# Altium schematic sheet E_ink_stuff.SchDoc
size 558 x 431 mm; SheetNumber: 3; SheetTotal: 8
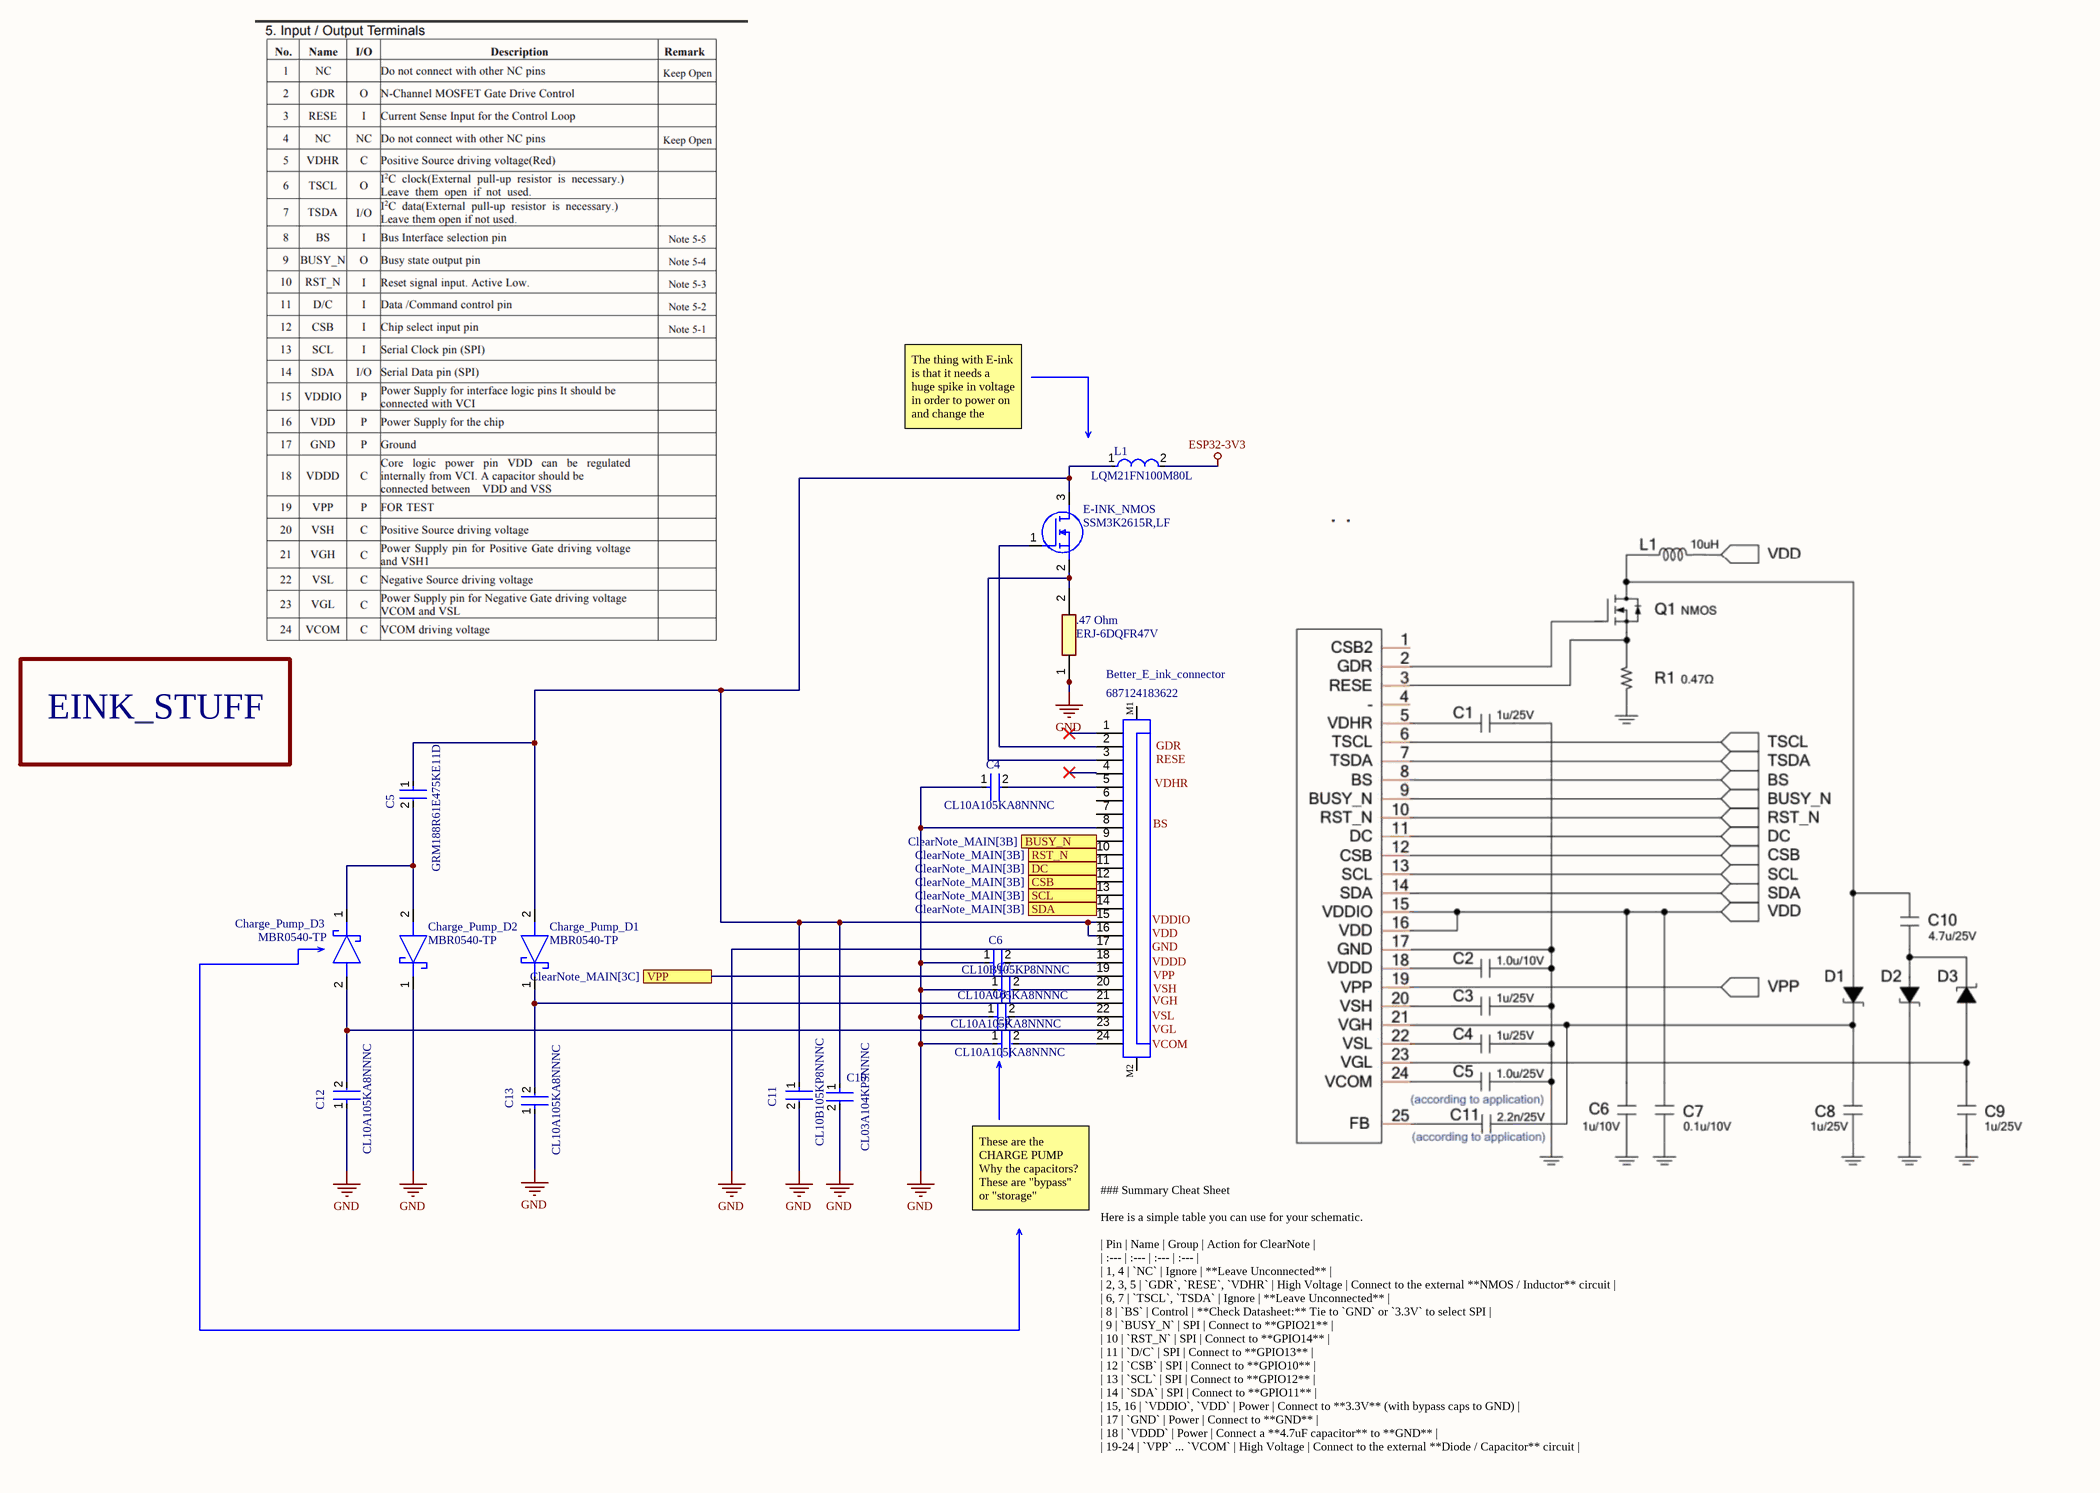
[diagram p0: E_ink_stuff.SchDoc]

## Parts
.47_Ohm  ERJ-6DQFR47V  [ERJ6_B_BW_R_LW_CW_D]
Better_E_ink_connector  687124183622  [687124183622]
C4  CL10A105KA8NNNC  [FP-CL10-IPC_C]
C5  GRM188R61E475KE11D  [FP-GRM188-0_15-IPC_C]
C6  CL10B105KP8NNNC  [FP-CL10-IPC_C]
C7  CL10A105KA8NNNC  [FP-CL10-IPC_C]
C8  CL10A105KA8NNNC  [FP-CL10-IPC_C]
C9  CL10A105KA8NNNC  [FP-CL10-IPC_C]
C10  CL03A104KP3NNNC  [FP-CL03-IPC_C]
C11  CL10B105KP8NNNC  [FP-CL10-IPC_C]
C12  CL10A105KA8NNNC  [FP-CL10-IPC_C]
C13  CL10A105KA8NNNC  [FP-CL10-IPC_C]
Charge_Pump_D1  MBR0540-TP  [SOD3716X135N]
Charge_Pump_D2  MBR0540-TP  [SOD3716X135N]
Charge_Pump_D3  MBR0540-TP  [SOD3716X135N]
E-INK_NMOS  SSM3K2615R,LF  [SOTFL95P240X88-3N]
L1  LQM21FN100M80L  [FP-LQM21DH_70-IPC_C]

## Ports
BUSY_N (see ClearNote_MAIN[3B]), CSB (see ClearNote_MAIN[3B]), DC (see ClearNote_MAIN[3B]), RST_N (see ClearNote_MAIN[3B]), SCL (see ClearNote_MAIN[3B]), SDA (see ClearNote_MAIN[3B]), VPP (see ClearNote_MAIN[3C])

## Nets
ESP32-3V3: L1.2
GND: .47_Ohm.1 Better_E_ink_connector.8 Better_E_ink_connector.17 C4.1 C6.1 C7.1 C8.1 C9.1 C10.2 C11.2 C12.1 C13.1 Charge_Pump_D2.1(K)
BUSY_N: Better_E_ink_connector.9 ; port BUSY_N
CSB: Better_E_ink_connector.12 ; port CSB
DC: Better_E_ink_connector.11 ; port DC
RST_N: Better_E_ink_connector.10 ; port RST_N
SCL: Better_E_ink_connector.13 ; port SCL
SDA: Better_E_ink_connector.14 ; port SDA
VPP: Better_E_ink_connector.19 ; port VPP
Net.47_Ohm_2: .47_Ohm.2 Better_E_ink_connector.3 E-INK_NMOS.2(S)
NetBetter_E_ink_connector_2: Better_E_ink_connector.2 E-INK_NMOS.1(G)
NetBetter_E_ink_connector_5: Better_E_ink_connector.5 C4.2
NetBetter_E_ink_connector_15: Better_E_ink_connector.15 Better_E_ink_connector.16 C5.1 C10.1 C11.1 Charge_Pump_D1.2(A) E-INK_NMOS.3(D) L1.1
NetBetter_E_ink_connector_18: Better_E_ink_connector.18 C6.2
NetBetter_E_ink_connector_20: Better_E_ink_connector.20 C7.2
NetBetter_E_ink_connector_21: Better_E_ink_connector.21 C13.2 Charge_Pump_D1.1(K)
NetBetter_E_ink_connector_22: Better_E_ink_connector.22 C8.2
NetBetter_E_ink_connector_23: Better_E_ink_connector.23 C12.2 Charge_Pump_D3.2(A)
NetBetter_E_ink_connector_24: Better_E_ink_connector.24 C9.2
NetC5_2: C5.2 Charge_Pump_D2.2(A) Charge_Pump_D3.1(K)

Not connected (* = marked no-connect by the designer): Better_E_ink_connector 1* 4* 6 7 M1 M2

## Notes on the sheet
- The thing with E-ink is that it needs a huge spike in voltage in order to power on and change the display. Which is why we have an NMOS.
  What is an NMOS?
  The nmos basically is used when converting an input into a higher output, think of it like a small transformer tbh.
  Also the resistance on the bottom or the drain is .47 ohm is the ON resistance.
  With the 3.3v esp32-power being connected to an inductor that if you recall an inductor helps provide clean stable voltage to the system.
- EINK_STUFF
- (near Better_E_ink_connector) VDHR
- (near Better_E_ink_connector) GDR
- (near Better_E_ink_connector) RESE
- (near Better_E_ink_connector) BS
- (near Better_E_ink_connector) VDDIO
- (near Better_E_ink_connector) VDD
- (near Better_E_ink_connector) VDDD
- (near Better_E_ink_connector) GND
- (near Better_E_ink_connector) VPP
- (near Better_E_ink_connector) VSH
- (near Better_E_ink_connector) VGH
- (near Better_E_ink_connector) VSL
- (near Better_E_ink_connector) VGL
- (near Better_E_ink_connector) VCOM
- These are the CHARGE PUMP
  Why the capacitors? These are "bypass" or "storage" capacitors. Think of them as tiny, fast water towers for each voltage pin. Their job is to sit right on that voltage rail (VGH, VPP, etc.) and keep the voltage perfectly stable. They store a small amount of charge so if the chip suddenly needs power, the capacitor provides it instantly. They are essential for a clean, stable circuit.
- ### Summary Cheat Sheet
  Here is a simple table you can use for your schematic.
  | Pin | Name | Group | Action for ClearNote |
  | :--- | :--- | :--- | :--- |
  | 1, 4 | `NC` | Ignore | **Leave Unconnected** |
  | 2, 3, 5 | `GDR`, `RESE`, `VDHR` | High Voltage | Connect to the external **NMOS / Inductor** circuit |
  | 6, 7 | `TSCL`, `TSDA` | Ignore | **Leave Unconnected** |
  | 8 | `BS` | Control | **Check Datasheet:** Tie to `GND` or `3.3V` to select SPI |
  | 9 | `BUSY_N` | SPI | Connect to **GPIO21** |
  | 10 | `RST_N` | SPI | Connect to **GPIO14** |
  | 11 | `D/C` | SPI | Connect to **GPIO13** |
  | 12 | `CSB` | SPI | Connect to **GPIO10** |
  | 13 | `SCL` | SPI | Connect to **GPIO12** |
  | 14 | `SDA` | SPI | Connect to **GPIO11** |
  | 15, 16 | `VDDIO`, `VDD` | Power | Connect to **3.3V** (with bypass caps to GND) |
  | 17 | `GND` | Power | Connect to **GND** |
  | 18 | `VDDD` | Power | Connect a **4.7uF capacitor** to **GND** |
  | 19-24 | `VPP` ... `VCOM` | High Voltage | Connect to the external **Diode / Capacitor** circuit |
- DWG. NO.
- REV.
- SHT.
- REVISION
- DESCRIPTION
- DATE
- APPROVED
- THIS DOCUMENT AND THE DATA DISCLOSED HEREIN OR HEREWITH IS THE PROPERTY OF ALTIUM LIMITED AND MAY BE FREELY DISTRIBUTED IN WHOLE. NO RIGHTS ARE RESERVED OR EXPRESS OR IMPLIED WARANTEE GIVEN.
- ENG:
- DSN:
- APPROVALS
- PROJECT
- DOCUMENT REVISION:
- DESIGN ITEM:
- CHK:
- BOM:
- REFERENCE DOCUMENTS
- PROJECT REVISION:
- TITLE
- FAB DWG:
- PCB DWG:
- ASSY DWG:
- SCALE:
- SIZE
- C
- CAGE CODE
- FILE NAME
- DWG NO.
- SHEET
- OF
- REV

## Library data of the parts
.47_Ohm = ERJ-6DQFR47V: Resistor; Manufacturer_Name: Panasonic; Datasheet Link: http://industrial.panasonic.com/cdbs/www-data/pdf/RDN0000/AOA0000C313.pdf; Manufacturer_Part_Number: ERJ-6DQFR47V; Mouser Part Number: 667-ERJ-6DQFR47V; Mouser Price/Stock: https://www.mouser.co.uk/ProductDetail/Panasonic/ERJ-6DQFR47V?qs=WO7YBshssFErZn4RyqgQ6w%3D%3D
Better_E_ink_connector = CMP-1502-01598-2: NexarPartId: 81848343; Contact Resistance: 30mΩ; Operating Supply Voltage: 50V; Gender: Receptacle; Pitch: 500µm; Insulation Resistance: 100MΩ; Current Rating: 400mA; Min Operating Temperature: -25°C; Max Operating Temperature: 85°C; Packaging: Tape and Reel; Length: 12.6mm; Lead Pitch: 500µm; Orientation: Horizontal; Number of Pins: 24; RoHS: Compliant
C4 C7-C9 C12 C13 = CMP-13271-004127-1: Cap Ceramic 1uF 25V X5R ±10% Pad SMD 0603 +85°C T/R; Height: 0.8mm; Capacitance: 1uF; Depth: 0.8mm; Package Quantity: 1; Mount: Surface Mount; Contact Plating: Tin; Voltage Rating: 25V; Dielectric: X5R; Packaging: Tape and Reel; Material: Ceramic; Case Code (Metric): 1608; Length: 1.6mm; Voltage: 25V; Min Operating Temperature: -55°C; Width: 0.031inch; Tolerance: 10%; Case/Package: 0603; Radiation Hardening: No; Case Code (Imperial): 0603; Thickness: 0.035inch; Lead Free: Lead Free; Max Operating Temperature: 85°C; Voltage Rating (DC): 25V
C5 = CMP-2006-02523-2: Chip Multilayer Ceramic Capacitors for General Purpose, 0603, 4.7uF, X5R, 15%, 10%, 25V; Case Code (Metric): 1608; Max Operating Temperature: 85°C; REACH SVHC: No SVHC; Voltage Rating: 25V; Dielectric: X5R; Packaging: Cut Tape; Width: 0.031inch; Min Operating Temperature: -55°C; Lead Free: Lead Free; Capacitance: 4.7uF; Height: 0.8mm; Case Code (Imperial): 0603; Length: 1.6mm; Voltage Rating (DC): 25V; Case/Package: 0603; Voltage: 25V; Tolerance: 10%; Thickness: 0.031inch; Mount: Surface Mount; Material: Ceramic; Package Quantity: 4000; Depth: 0.8mm
C6 C11 = CMP-2000-06094-2: Cap Ceramic 1uF 10V X7R ±10% Pad SMD 0603 +125°C T/R; Packaging: Tape and Reel; Depth: 0.8mm; Voltage Rating: 10V; Lead Free: Lead Free; Radiation Hardening: No; Capacitance: 1uF; Length: 1.6mm; Package Quantity: 1; Mount: Surface Mount; Case/Package: 0603; Max Operating Temperature: 125°C; Case Code (Metric): 1608; Height: 0.8mm; Min Operating Temperature: -55°C; Dielectric: X7R; Contact Plating: Tin; Case Code (Imperial): 0603; Thickness: 0.035inch; Voltage Rating (DC): 10V; Tolerance: 10%; Width: 0.031inch
C10 = CMP-2010-00672-2: Cap Ceramic 100nF 10V X5R ±10% Pad SMD 0201 +85°C T/R; Radiation Hardening: No; Voltage Rating: 10V; Dielectric: X5R; Length: 0.6mm; Voltage Rating (DC): 10V; Package Quantity: 1; Height: 0.3mm; Width: 0.012inch; Min Operating Temperature: -55°C; Lead Free: Lead Free; Tolerance: 10%; Contact Plating: Tin; Depth: 0.3mm; Max Operating Temperature: 85°C; Case/Package: 0201; Capacitance: 100nF; Mount: Surface Mount; Thickness: 0.013inch; Case Code (Metric): 0603; Case Code (Imperial): 0201; Packaging: Tape and Reel
Charge_Pump_D1-Charge_Pump_D3 = MBR0540-TP: Schottky Diode; Manufacturer_Name: MCC; Datasheet Link: https://mccsemi.com/pdf/Products/MBR0520-MBR0580(SOD123).pdf; Height: 1.35mm; Manufacturer_Part_Number: MBR0540-TP; Mouser Part Number: 833-MBR0540-TP; Mouser Price/Stock: https://www.mouser.co.uk/ProductDetail/Micro-Commercial-Components-MCC/MBR0540-TP?qs=Vo7e0yZOYdEH3ZK7VsaoCA%3D%3D; Arrow Part Number: MBR0540-TP; Arrow Price/Stock: https://www.arrow.com/en/products/mbr0540-tp/micro-commercial-components?utm_currency=USD&region=nac
E-INK_NMOS = SSM3K2615R,LF: MOSFET (N-Channel); Manufacturer_Name: Toshiba; Datasheet Link: http://toshiba.semicon-storage.com/info/docget.jsp?did=15672&prodName=SSM3K2615R; Height: 0.88mm; Manufacturer_Part_Number: SSM3K2615R,LF; Mouser Part Number: 757-SSM3K2615RLF; Mouser Price/Stock: https://www.mouser.co.uk/ProductDetail/Toshiba/SSM3K2615RLF?qs=bKenfurwlsmmBG7lMelwgg%3D%3D; Arrow Part Number: SSM3K2615R,LF; Arrow Price/Stock: https://www.arrow.com/en/products/ssm3k2615rlf/toshiba?utm_currency=USD&region=nac
L1 = CMP-06042-014493-1: Multilayer Type Inductor for Power Lines, 0805 (2012), 10μH, 20%, 0.39Ω, 100mA; Self Resonant Frequency: 15MHz; Test Frequency: 1MHz; DC Resistance (DCR): 300mR; Shielding: Shielded; Core Material: Ferrite; Inductance: 10uH; Depth: 1.45mm; Length: 2mm; Mount: Surface Mount; Case Code (Imperial): 0805; Max Operating Temperature: 125°C; Tolerance: 20%; Case Code (Metric): 2012; Lead Free: Lead Free; Case/Package: 0805; Radiation Hardening: No; Termination: SMD/SMT; Min Operating Temperature: -40°C; Packaging: Tape and Reel; Height: 1.25mm; DC Current: 100mA; Package Quantity: 3000; Inductance Tolerance: 20%; Current Rating: 100mA; Max DC Current: 100mA; Military Standard: Not; Width: 1.25mm; REACH SVHC: No SVHC